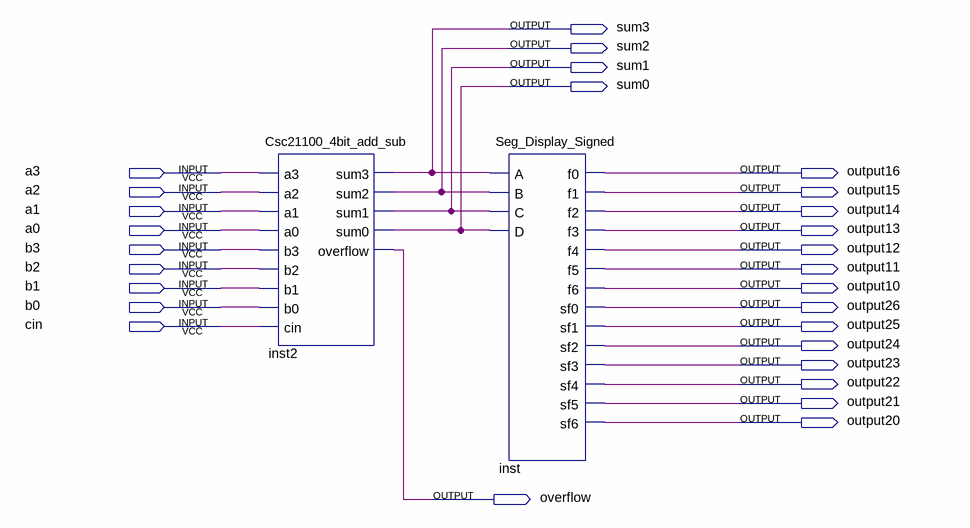
[diagram p0: schematic sheet]
// Quartus schematic Signed_Decimal_Block.bdf as structural Verilog: 2 symbols, 28 pins
module Signed_Decimal_Block (
  input  a3,
  input  a2,
  input  a1,
  input  a0,
  input  b3,
  input  b2,
  input  b1,
  input  b0,
  input  cin,
  output sum3,
  output sum2,
  output sum1,
  output sum0,
  output output16,
  output output15,
  output output14,
  output output13,
  output output12,
  output output11,
  output output10,
  output output26,
  output output25,
  output output24,
  output output23,
  output output22,
  output output21,
  output output20,
  output overflow
);

  Csc21100_4bit_add_sub inst2 (
    .a3(a3), .a2(a2), .a1(a1), .a0(a0), .b3(b3), .b2(b2), .b1(b1), .b0(b0), .cin(cin), .sum3(sum3),
    .sum2(sum2), .sum1(sum1), .sum0(sum0), .overflow(overflow));
  Seg_Display_Signed inst (
    .A(sum3), .B(sum2), .C(sum1), .D(sum0), .f0(output16), .f1(output15), .f2(output14), .f3(output13),
    .f4(output12), .f5(output11), .f6(output10), .sf0(output26), .sf1(output25), .sf2(output24),
    .sf3(output23), .sf4(output22), .sf5(output21), .sf6(output20));
endmodule
